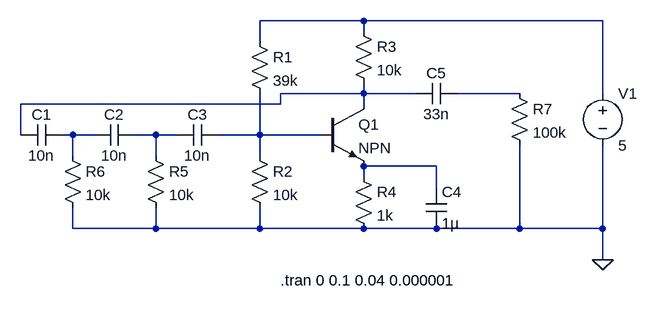
[diagram p0: schematic Oscillator - Run.asc]
Oscillator - Run.asc, the LTspice schematic file:
Version 4
SHEET 1 880 680
WIRE 272 16 112 16
WIRE 640 16 272 16
WIRE 272 32 272 16
WIRE 112 48 112 16
WIRE 272 128 272 112
WIRE 272 128 144 128
WIRE 352 128 272 128
WIRE 512 128 416 128
WIRE 640 128 640 16
WIRE 144 144 144 128
WIRE 144 144 -256 144
WIRE 272 144 272 128
WIRE -256 192 -256 144
WIRE -176 192 -192 192
WIRE -144 192 -176 192
WIRE -48 192 -80 192
WIRE -16 192 -48 192
WIRE 112 192 112 128
WIRE 112 192 48 192
WIRE 208 192 112 192
WIRE -176 224 -176 192
WIRE -48 224 -48 192
WIRE 112 224 112 192
WIRE 384 240 272 240
WIRE 272 256 272 240
WIRE 384 272 384 240
WIRE -176 336 -176 304
WIRE -48 336 -48 304
WIRE -48 336 -176 336
WIRE 112 336 112 304
WIRE 112 336 -48 336
WIRE 272 336 112 336
WIRE 384 336 272 336
WIRE 512 336 512 208
WIRE 512 336 384 336
WIRE 640 336 640 208
WIRE 640 336 512 336
WIRE 640 384 640 336
WIRE 656 384 640 384
FLAG 640 384 0
SYMBOL npn 208 144 R0
SYMATTR InstName Q1
SYMBOL cap -192 176 R90
WINDOW 0 0 32 VBottom 0
WINDOW 3 32 32 VTop 0
SYMATTR InstName C1
SYMATTR Value 10n
SYMBOL cap -80 176 R90
WINDOW 0 0 32 VBottom 0
WINDOW 3 32 32 VTop 0
SYMATTR InstName C2
SYMATTR Value 10n
SYMBOL cap 48 176 R90
WINDOW 0 0 32 VBottom 0
WINDOW 3 32 32 VTop 0
SYMATTR InstName C3
SYMATTR Value 10n
SYMBOL cap 368 272 R0
SYMATTR InstName C4
SYMATTR Value 1µ
SYMBOL res 96 32 R0
SYMATTR InstName R1
SYMATTR Value 39k
SYMBOL res 96 208 R0
SYMATTR InstName R2
SYMATTR Value 10k
SYMBOL res 256 16 R0
SYMATTR InstName R3
SYMATTR Value 10k
SYMBOL res 256 240 R0
SYMATTR InstName R4
SYMATTR Value 1k
SYMBOL res -64 208 R0
SYMATTR InstName R5
SYMATTR Value 10k
SYMBOL res -192 208 R0
SYMATTR InstName R6
SYMATTR Value 10k
SYMBOL voltage 640 112 R0
WINDOW 123 0 0 Left 0
WINDOW 39 0 0 Left 0
SYMATTR InstName V1
SYMATTR Value 5
SYMBOL cap 416 112 R90
WINDOW 0 0 32 VBottom 0
WINDOW 3 32 32 VTop 0
SYMATTR InstName C5
SYMATTR Value 33n
SYMBOL res 496 112 R0
SYMATTR InstName R7
SYMATTR Value 100k
TEXT 144 416 Left 0 !.tran 0 0.1 0.04 0.000001

The netlist it stands for:
* Oscillator - Run.asc
Q1 N002 N006 N007 0 NPN
C1 N004 N002 10n
C2 N005 N004 10n
C3 N006 N005 10n
C4 N007 0 1µ
R1 N001 N006 39k
R2 N006 0 10k
R3 N001 N002 10k
R4 N007 0 1k
R5 N005 0 10k
R6 N004 0 10k
V1 N001 0 5
C5 N003 N002 33n
R7 N003 0 100k
.model NPN NPN
.model PNP PNP
.lib standard.bjt
.tran 0 0.1 0.04 0.000001
.backanno
.end